# EAGLE schematic PX2FMU_testjig_center (EAGLE 5.11)
BOM: EXCLUDE; PARTNO: *
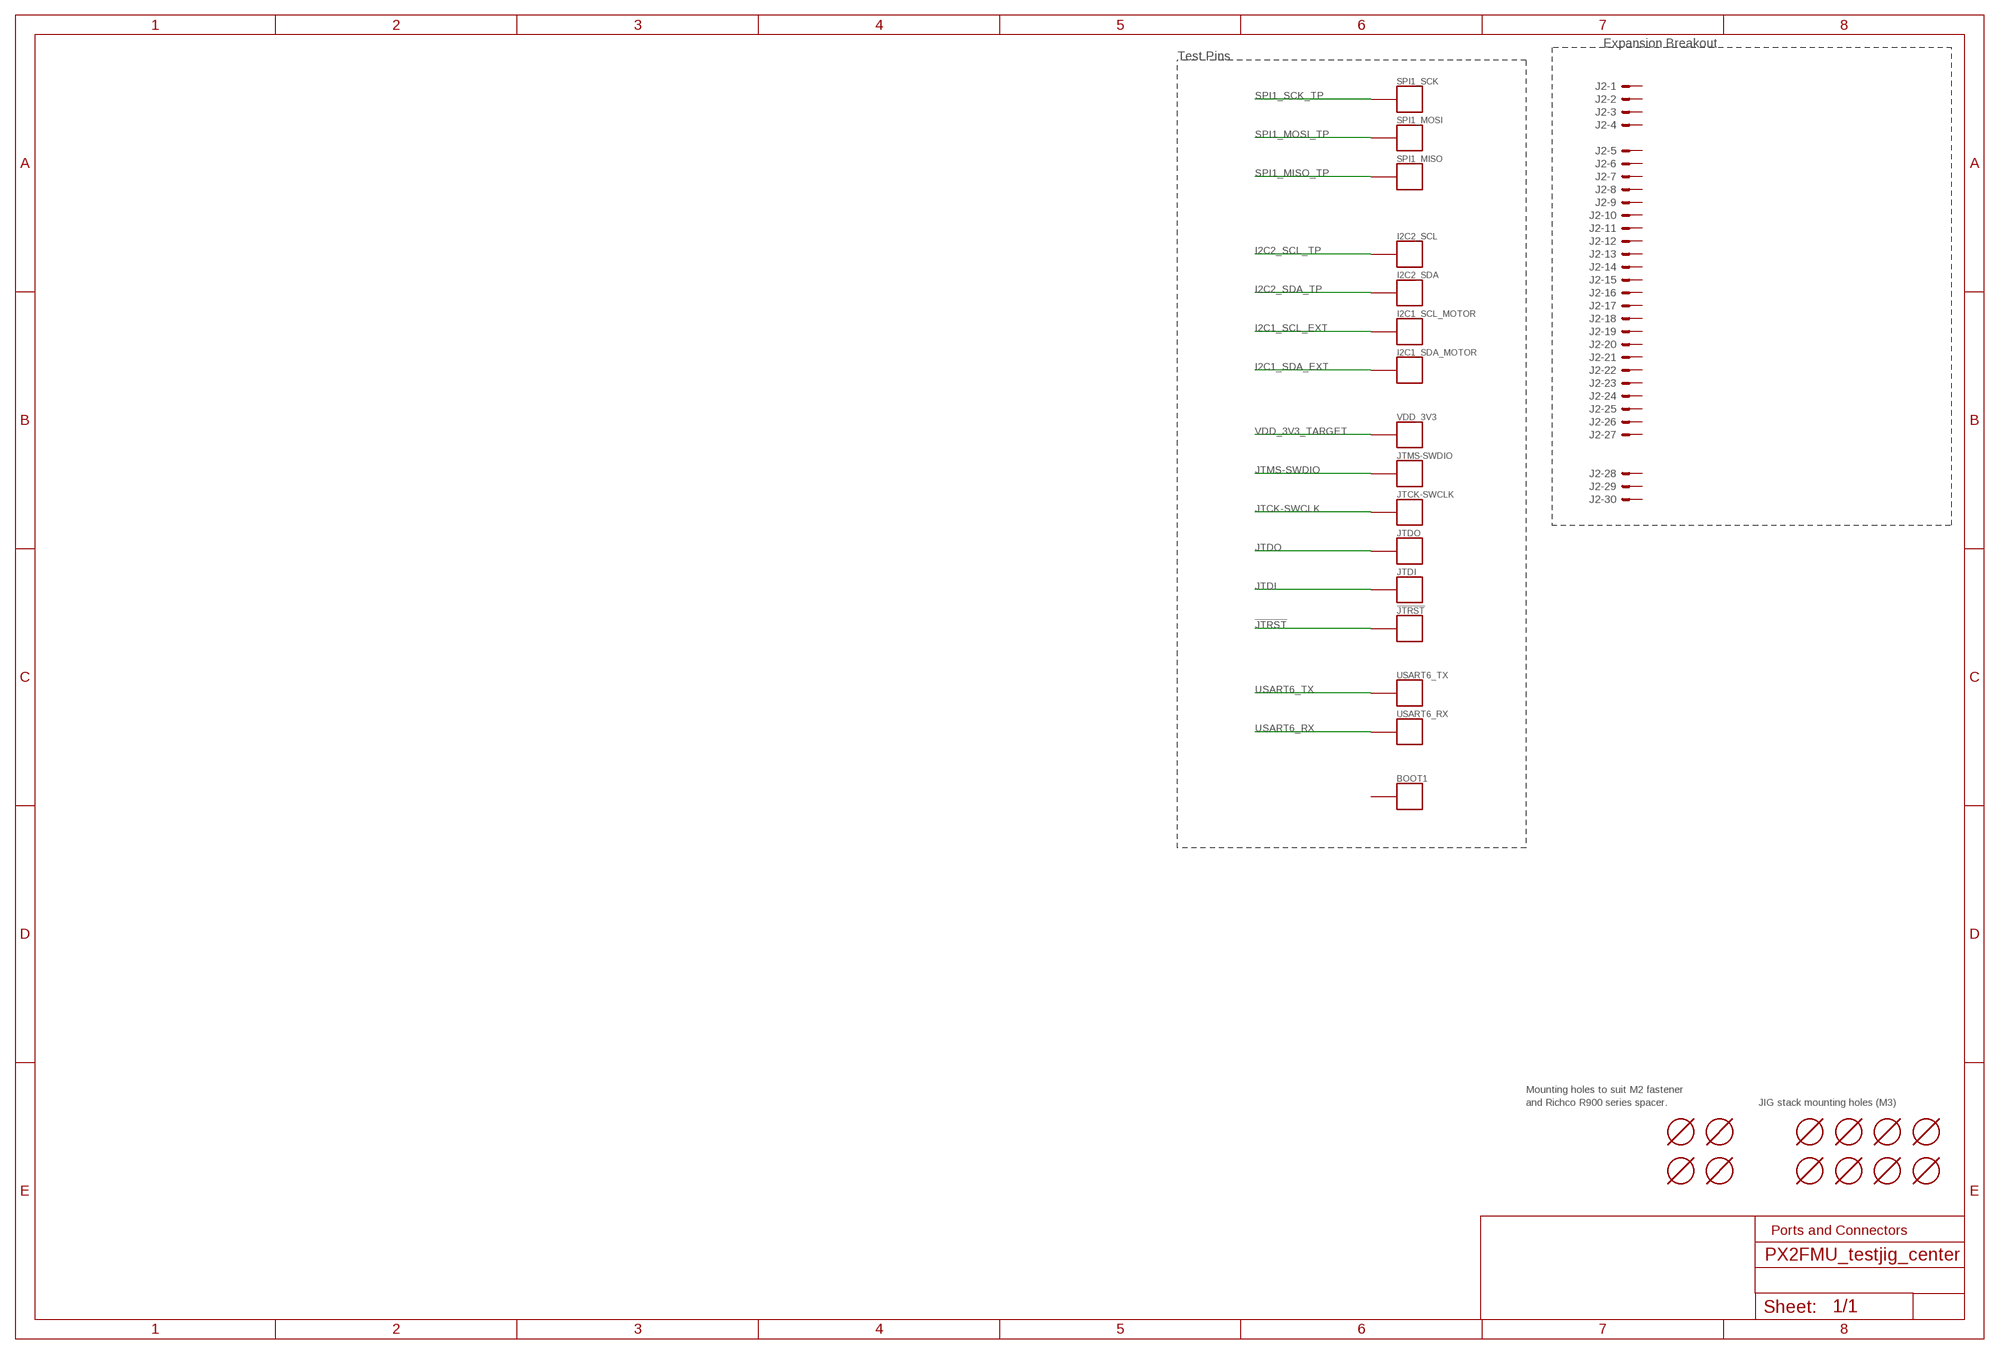
[diagram p0: schematic, sheet 1]

## Parts
!JTRST  PAD-HOLE  [POGO-HOLE]
BOOT1  PAD-HOLE  [POGO-HOLE]
I2C1_SCL_MOTOR  PAD-POGO  [POGO]
I2C1_SDA_MOTOR  PAD-POGO  [POGO]
I2C2_SCL  PAD-HOLE  [POGO-HOLE]
I2C2_SDA  PAD-HOLE  [POGO-HOLE]
J2  HEADER_2X15-POGO  [HEADER_2MM_2X15_POGO]
JTCK-SWCLK  PAD-POGO  [POGO]
JTDI  PAD-POGO  [POGO]
JTDO  PAD-POGO  [POGO]
JTMS-SWDIO  PAD-POGO  [POGO]
SPI1_MISO  PAD-HOLE  [POGO-HOLE]
SPI1_MOSI  PAD-HOLE  [POGO-HOLE]
SPI1_SCK  PAD-HOLE  [POGO-HOLE]
U$1  MOUNT-HOLE3.1MM  [MOUNT-HOLE3.1]
U$2  MOUNT-HOLE3.1MM  [MOUNT-HOLE3.1]
U$3  MOUNT-HOLE3.1MM  [MOUNT-HOLE3.1]
U$4  MOUNT-HOLE3.1MM  [MOUNT-HOLE3.1]
U$5  MOUNT-HOLE2.1MM  [MOUNT-HOLE2.1]
U$6  MOUNT-HOLE2.1MM  [MOUNT-HOLE2.1]
U$7  MOUNT-HOLE2.1MM  [MOUNT-HOLE2.1]
U$8  MOUNT-HOLE2.1MM  [MOUNT-HOLE2.1]
U$9  MOUNT-HOLE3.1MM  [MOUNT-HOLE3.1]
U$10  MOUNT-HOLE3.1MM  [MOUNT-HOLE3.1]
U$11  MOUNT-HOLE3.1MM  [MOUNT-HOLE3.1]
U$12  MOUNT-HOLE3.1MM  [MOUNT-HOLE3.1]
USART6_RX  PAD-HOLE  [POGO-HOLE]
USART6_TX  PAD-HOLE  [POGO-HOLE]
VDD_3V3  PAD-HOLE  [POGO-HOLE]

## Nets
!JTRST: !JTRST.P$1
I2C1_SCL_EXT: I2C1_SCL_MOTOR.P$1
I2C1_SDA_EXT: I2C1_SDA_MOTOR.P$1
I2C2_SCL_TP: I2C2_SCL.P$1
I2C2_SDA_TP: I2C2_SDA.P$1
JTCK-SWCLK: JTCK-SWCLK.P$1
JTDI: JTDI.P$1
JTDO: JTDO.P$1
JTMS-SWDIO: JTMS-SWDIO.P$1
SPI1_MISO_TP: SPI1_MISO.P$1
SPI1_MOSI_TP: SPI1_MOSI.P$1
SPI1_SCK_TP: SPI1_SCK.P$1
USART6_RX: USART6_RX.P$1
USART6_TX: USART6_TX.P$1
VDD_3V3_TARGET [power]: VDD_3V3.P$1
Unconnected: BOOT1.P$1 J2.1 J2.2 J2.3 J2.4 J2.5 J2.6 J2.7 J2.8 J2.9 J2.10 J2.11 J2.12 J2.13 J2.14 J2.15 J2.16 J2.17 J2.18 J2.19 J2.20 J2.21 J2.22 J2.23 J2.24 J2.25 J2.26 J2.27 J2.28 J2.29 J2.30

## Notes on the sheet
- Expansion Breakout
- Test Pins
- Mounting holes to suit M2 fastener
- and Richco R900 series spacer. | JIG stack mounting holes (M3)
- Ports and Connectors

## Library data of the parts
!JTRST BOOT1 I2C1_SCL_MOTOR I2C1_SDA_MOTOR I2C2_SCL I2C2_SDA JTCK-SWCLK JTDI JTDO JTMS-SWDIO SPI1_MISO SPI1_MOSI SPI1_SCK USART6_RX USART6_TX VDD_3V3 = pixhawk2:PAD: Test pad This footprint includes three classes: The actual test pads, a pogo-pin footprint to mount the pogo-pin as through-hole part and a hole footprint which allows the head of the pogo-pin to pass through (do NOT use the hole to mount the pogo-pin). In a typical test setup, the stack would consist of three PCBs: The actual PCB under testing with a test pad on the bottom, then a second PCB with the hole for the pogo-pin head where the PCB under testing is pressed on and a third PCB at 30 mm / 1.2" distance with the pogo-pin footprints. The pogo-pins are soldered to the last PCB. To create the stack, copy the board under testing and exchange the footprints - this way the correct positioning is ensured.
J2 = pixhawk2:HEADER_2X15: 2X15 header
U$1-U$12 = pixhawk2:MOUNT-HOLE

## Net classes
0 signal: width 0.203 mm, drill 0.3 mm, clearance 0.203 mm
1 power: width 0.254 mm, drill 0.3 mm, clearance 0.203 mm